# EAGLE design PSU-Board-V2-0 (EAGLE 7.3.0)
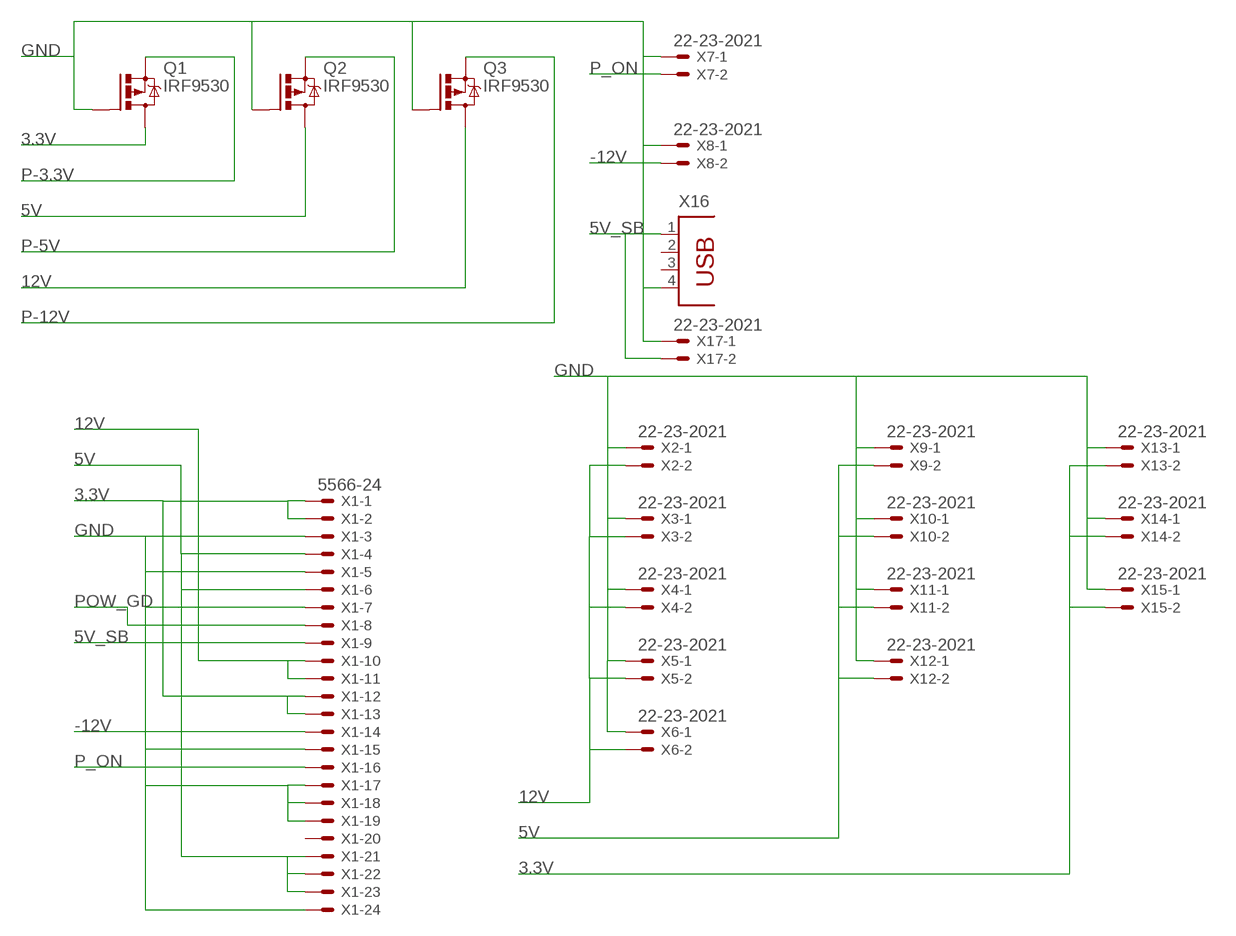
[diagram p0: schematic, sheet 1]

## Parts
Q1  IRF9530  [TO220BV]
Q2  IRF9530  [TO220BV]
Q3  IRF9530  [TO220BV]
X1  5566-24  [5566-24]
X2  22-23-2021  [22-23-2021]
X3  22-23-2021  [22-23-2021]
X4  22-23-2021  [22-23-2021]
X5  22-23-2021  [22-23-2021]
X6  22-23-2021  [22-23-2021]
X7  22-23-2021  [22-23-2021]
X8  22-23-2021  [22-23-2021]
X9  22-23-2021  [22-23-2021]
X10  22-23-2021  [22-23-2021]
X11  22-23-2021  [22-23-2021]
X12  22-23-2021  [22-23-2021]
X13  22-23-2021  [22-23-2021]
X14  22-23-2021  [22-23-2021]
X15  22-23-2021  [22-23-2021]
X16  PN87520  [PN87520]
X17  22-23-2021  [22-23-2021]

## Nets
3.3V: Q1.D X1.1 X1.2 X1.12 X1.13 X13.2 X14.2 X15.2
5V: Q2.D X1.4 X1.6 X1.21 X1.22 X1.23 X9.2 X10.2 X11.2 X12.2
5V_SB: X1.9 X16.1 X17.2
12V: Q3.D X1.10 X1.11 X2.2 X3.2 X4.2 X5.2 X6.2
-12V: X1.14 X8.2
GND: Q1.G Q2.G Q3.G X1.3 X1.5 X1.7 X1.15 X1.17 X1.18 X1.19 X1.24 X2.1 X3.1 X4.1 X5.1 X6.1 X7.1 X8.1 X9.1 X10.1 X11.1 X12.1 X13.1 X14.1 X15.1 X16.4 X17.1
P-3.3V: Q1.S
P-5V: Q2.S
P-12V: Q3.S
P_ON: X1.16 X7.2
POW_GD: X1.8
Unconnected: X1.20 X16.2 X16.3

## Library data of the parts
Q1-Q3 = transistor-power:IRF9530: P-CHANNEL HEXFET POWER-MOS-FET Source: http://www.irf.com/product-info/datasheets/data/irf9530.pdf
X1 = con-molex:5566-24: Mini FIT connector 24 pol Source: http://www.molex.com; OC_FARNELL: unknown; OC_NEWARK: unknown
X2-X15 X17 = con-molex:22-23-2021: .100" (2.54mm) Center Header - 2 Pin; MF: MOLEX; MPN: 22-23-2021; OC_FARNELL: 1462926; OC_NEWARK: 25C3832
X16 = con-berg:PN87520: BERG USB connector; OC_FARNELL: unknown; OC_NEWARK: unknown

## Board
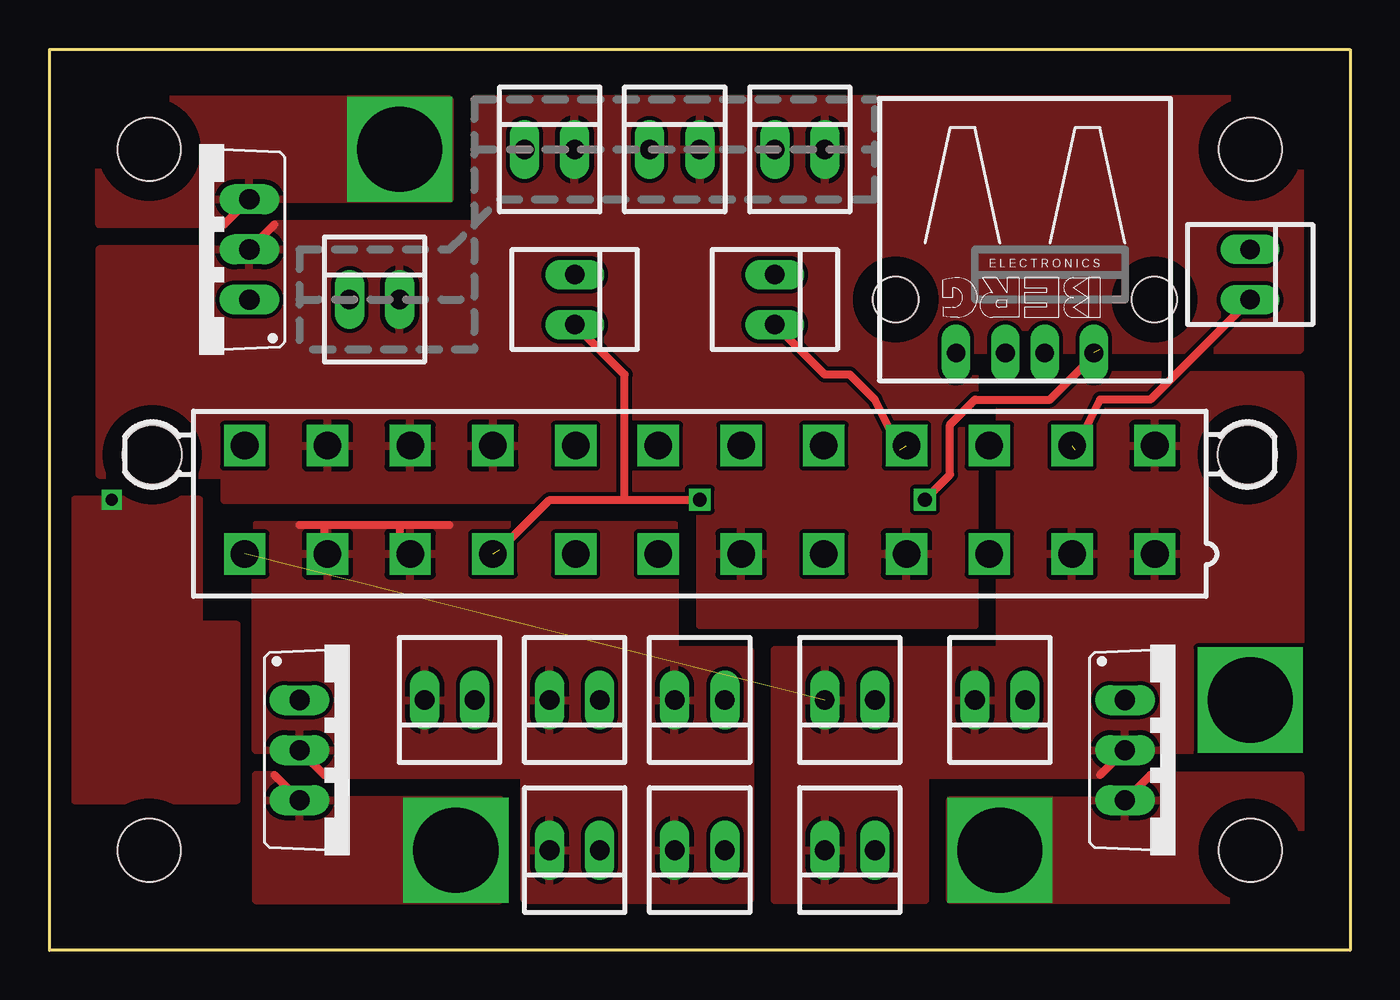
[diagram p1: board, top side]
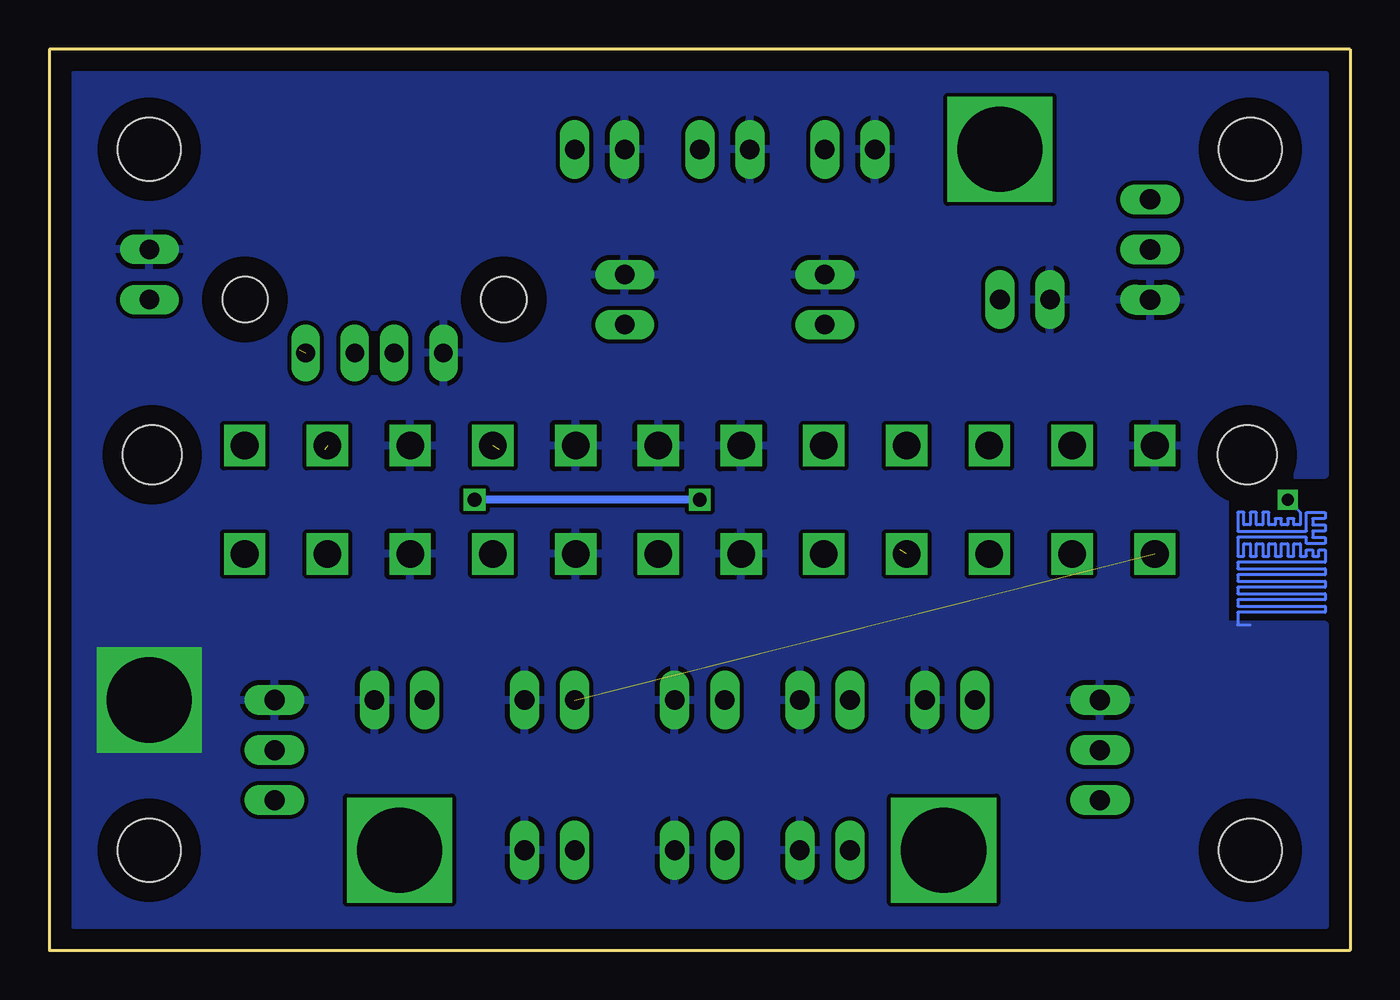
[diagram p2: board, bottom side, seen from below]

Size 66.04 x 45.72 mm. Coordinates in mm from the lower left corner, seen from the top.
Outline: 0,45.72 66.04,45.72 66.04,0 0,0 0,45.72
Copper layers (1*16): Top 0.035mm / dielectric 1.5mm / Bottom 0.035mm
Design rules "default": minimum track width 10mil, minimum drill 24mil, track to track 8mil, track to pad 8mil, pad to pad 8mil, via to via 8mil, smd to smd 8mil, copper to edge 40mil, drill to drill 8mil, minimum pad ring 10mil, minimum via ring 8mil, stop-mask expansion 4mil, vias tented up to drill 0mil, thermal gap 10mil
Holes 3.2 mm at 5.08,40.64 5.08,5.08 60.96,40.64 60.96,5.08

### Footprints (pad centres in the part's own frame; a part is rotated, then mirrored left to right if it is on the bottom)
TO220BV = drill 1.016 long: D 0,-2.54; G -2.54,-2.54; S 2.54,-2.54
5566-24 = drill 1.4 square: 1 23.1,-2.75; 2 18.9,-2.75; 3 14.7,-2.75; 4 10.5,-2.75; 5 6.3,-2.75; 6 2.1,-2.75; 7 -2.1,-2.75; 8 -6.3,-2.75; 9 -10.5,-2.75; 10 -14.7,-2.75; 11 -18.9,-2.75; 12 -23.1,-2.75; 13 23.1,2.75; 14 18.9,2.75; 15 14.7,2.75; 16 10.5,2.75; 17 6.3,2.75; 18 2.1,2.75; 19 -2.1,2.75; 20 -6.3,2.75; 21 -10.5,2.75; 22 -14.7,2.75; 23 -18.9,2.75; 24 -23.1,2.75 | hole 3: 27.8,2.29; -27.8,2.29
22-23-2021 = drill 1 long: 1 -1.27,0; 2 1.27,0
PN87520 = drill 0.95 long: 1 -3.5,2.71; 2 -1,2.71; 3 1,2.71; 4 3.5,2.71 | hole 2.3: -6.57,0; 6.57,0

### Placement (x,y rotation side)
Q1  57.15,10.16 270 top
Q2  7.62,35.56 90 top
Q3  15.24,10.16 270 top
X1  33.02,22.86 0 top
X2  33.02,12.7 180 top
X3  26.67,5.08 180 top
X4  26.67,12.7 180 top
X5  33.02,5.08 180 top
X6  20.32,12.7 180 top
X7  36.83,33.02 270 top
X8  60.96,34.29 270 top
X9  16.51,33.02 0 top
X10  25.4,40.64 0 top
X11  38.1,40.64 0 top
X12  31.75,40.64 0 top
X13  48.26,12.7 180 top
X14  40.64,5.08 180 top
X15  40.64,12.7 180 top
X16  49.53,33.02 180 top
X17  26.67,33.02 270 top

### Tracks (layer width: path | path; a pad name or v marks a point on that pad's centre or on a via)
3.3V  (1 unrouted)
  Top 0.406: Q1.D 53.34,8.89
  pour Top: 36.83,15.24 48.26,15.24 48.26,29.21 63.5,29.21 63.5,10.16 54.61,10.16 53.34,8.89 44.45,8.89 44.45,2.54 36.83,2.54
5V
  Top 0.406: Q2.D 11.43,36.83
  pour Top: 33.02,16.51 46.99,16.51 46.99,30.48 63.5,30.48 63.5,43.18 21.59,43.18 21.59,36.83 11.43,36.83 10.16,35.56 2.54,35.56 2.54,24.13 8.89,24.13 8.89,22.86 33.02,22.86
5V_SB  (via drill 0.7)  (2 unrouted)
  Top 0.406: 22.86,20.32 25.4,22.86 29.21,22.86 | 29.21,22.86 v33.02,22.86 | v44.45,22.86 45.72,24.13 45.72,26.67 46.99,27.94 50.8,27.94 53.34,30.48 | 29.21,22.86 29.21,29.21 X17.2
  Bottom 0.406: v33.02,22.86 v44.45,22.86
12V
  Top 0.406: Q3.D 13.97,8.89 | 12.7,21.59 13.97,21.59 | 13.97,21.59 17.78,21.59 | 17.78,21.59 20.32,21.59 | 13.97,20.32 13.97,21.59 | 17.78,21.59 17.78,20.32
  pour Top: 10.48,21.59 31.75,21.59 31.75,15.24 35.56,15.24 35.56,2.54 24.13,2.54 24.13,8.89 13.97,8.89 12.7,10.16 10.48,10.16
-12V  (1 unrouted)
  Top 0.406: X8.2 55.88,27.94 53.34,27.94 52.07,25.4
GND  (via drill 0.6, 4.32)
  Bottom 0.152: v3.18,22.86 2.54,22.23 2.54,21.59 2.86,21.59 2.86,21.91 3.18,21.91 3.18,21.59 3.49,21.59 3.49,21.91 3.81,21.91 3.81,21.59 4.13,21.59 4.13,22.23 4.45,22.23 4.45,21.59 4.76,21.59 4.76,22.23 5.08,22.23 5.08,21.59 5.4,21.59 5.4,22.23 5.72,22.23 5.72,21.27 2.22,21.27 2.22,22.23 1.27,22.23 1.27,21.91 1.91,21.91 1.91,21.59 1.27,21.59 1.27,21.27 1.91,21.27 1.91,20.95 1.27,20.95 1.27,20.64 2.22,20.64 2.22,20.95 5.72,20.95 5.72,20 5.4,20 5.4,20.64 5.08,20.64 5.08,20 4.76,20 4.76,20.64 4.45,20.64 4.45,20 4.13,20 4.13,20.64 3.81,20.64 3.81,20 3.49,20 3.49,20.64 3.18,20.64 3.18,20 2.86,20 2.86,20.64 2.54,20.64 2.54,20 2.22,20 2.22,20.32 1.91,20.32 1.91,20 1.59,20 1.59,20.32 1.27,20.32 1.27,19.69 5.72,19.69 5.72,19.37 1.27,19.37 1.27,19.05 5.72,19.05 5.72,18.73 1.27,18.73 1.27,18.41 5.72,18.41 5.72,18.1 1.27,18.1 1.27,17.78 5.72,17.78 5.72,17.46 1.27,17.46 1.27,17.15 5.72,17.15 5.72,16.51 5.08,16.51
  other vias: 60.96,12.7
  pour Bottom: 1.27,1.27 1.27,16.51 6.35,16.51 6.35,24.13 1.27,24.13 1.27,44.45 64.77,44.45 64.77,1.27
  pour Top: 9.52,7.62 9.52,16.51 7.62,16.51 7.62,22.86 1.27,22.86 1.27,7.62
P-3.3V  (via drill 4.32)
  Top 0.406: Q1.S 55.88,8.89
  other vias: 48.26,5.08
  pour Top: 45.72,2.54 45.72,7.62 54.61,7.62 55.88,8.89 63.5,8.89 63.5,2.54
P-5V  (via drill 4.32)
  Top 0.406: Q2.S 8.89,36.83
  other vias: 17.78,40.64
  pour Top: 2.54,36.83 2.54,43.18 20.32,43.18 20.32,38.1 10.16,38.1 8.89,36.83
P-12V  (via drill 4.32)
  Top 0.406: Q3.S 11.43,8.89
  other vias: 20.64,5.08
  pour Top: 22.86,7.62 11.43,7.62 11.43,8.89 10.48,8.89 10.48,2.54 22.86,2.54
P_ON  (1 unrouted)
  Top 0.406: 43.18,25.4 41.91,27.94 40.64,29.21 39.37,29.21 X7.2

### Text on the board
tDocu: P-5V | ON | OFF | -12V | 5V_VSB | GND | © 2015 | P-12V | P-3.3V | ATX breakout board V2.0
bDocu: FenStar.co/p/2015/ATX-BOB | © Wesley Rogers 2015 ATX power breakout board REV 2.0